# EAGLE design rgb_led (EAGLE 5.07)
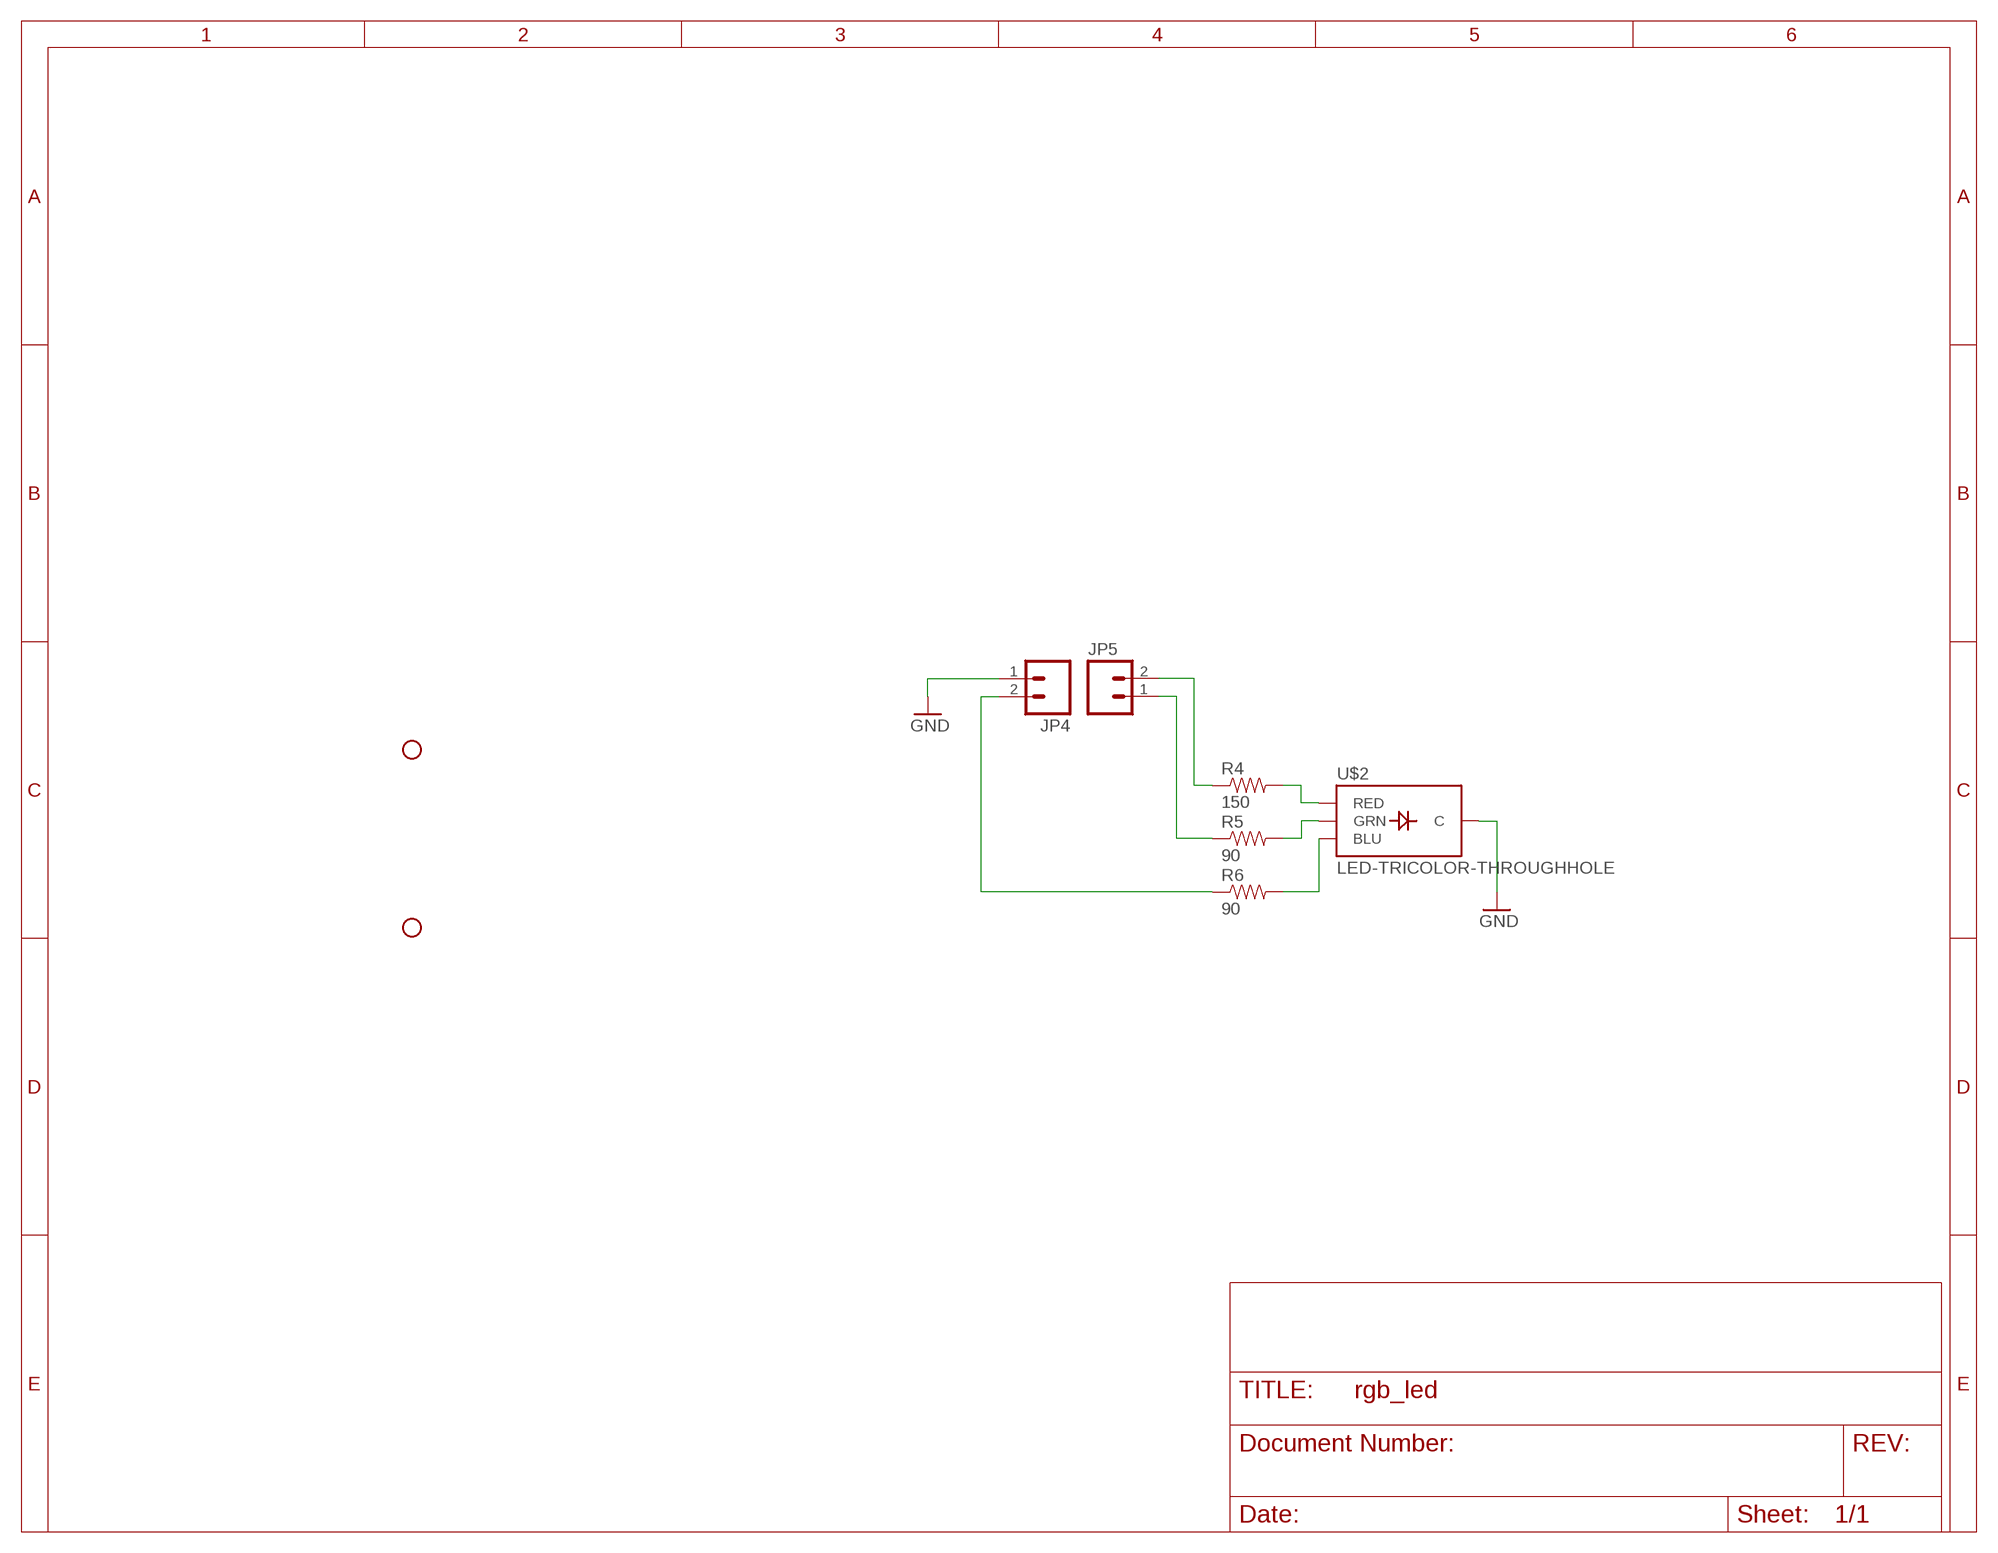
[diagram p0: schematic, sheet 1]

## Parts
JP4  M02PTH  [1X02]
JP5  M02PTH  [1X02]
JP9  STAND-OFF  [STAND-OFF]
JP10  STAND-OFF  [STAND-OFF]
R4  150  RESISTORPTH1  [AXIAL-0.3]
R5  90  RESISTORPTH1  [AXIAL-0.3]
R6  90  RESISTORPTH1  [AXIAL-0.3]
U$2  LED-TRICOLOR-THROUGHHOLE  [LED-TRICOLOR-THROUGHHOLE]

## Nets
GND: JP4.1 U$2.GND(C)
N$1: JP5.2 R4.P$1
N$2: JP5.1 R5.P$1
N$3: JP4.2 R6.P$1
N$4: R4.P$2 U$2.RED
N$5: R5.P$2 U$2.BLU(GRN)
N$17: R6.P$2 U$2.GRN(BLU)

## Library data of the parts
JP4 JP5 = SparkFun:M02: Header 2 Standard 2-pin 0.1" header. Use with straight break away headers (SKU : PRT-00116), right angle break away headers (PRT-00553), swiss pins (PRT-00743), machine pins (PRT-00117), and female headers (PRT-00115). Molex polarized connector foot print use with SKU : PRT-08233 with associated crimp pins and housings.
JP9 JP10 = SparkFun:STAND-OFF: Stand Off This is the mechanical footprint for a #4 phillips button head screw. Use the keepout ring to avoid running the screw head into surrounding components. SKU : PRT-00447
R4-R6 = SparkFun:RESISTOR: Resistor Basic schematic elements and footprints for 0603, 1206, and PTH 1/10th watt (small) resistors.
U$2 = SparkFun:LED-TRICOLOR-THROUGHHOLE

## Net classes
0 signal: width 0.381 mm, drill 0.813 mm, clearance 0.254 mm
1 drive: width 1.778 mm, drill 0.813 mm, clearance 0.254 mm

## Board
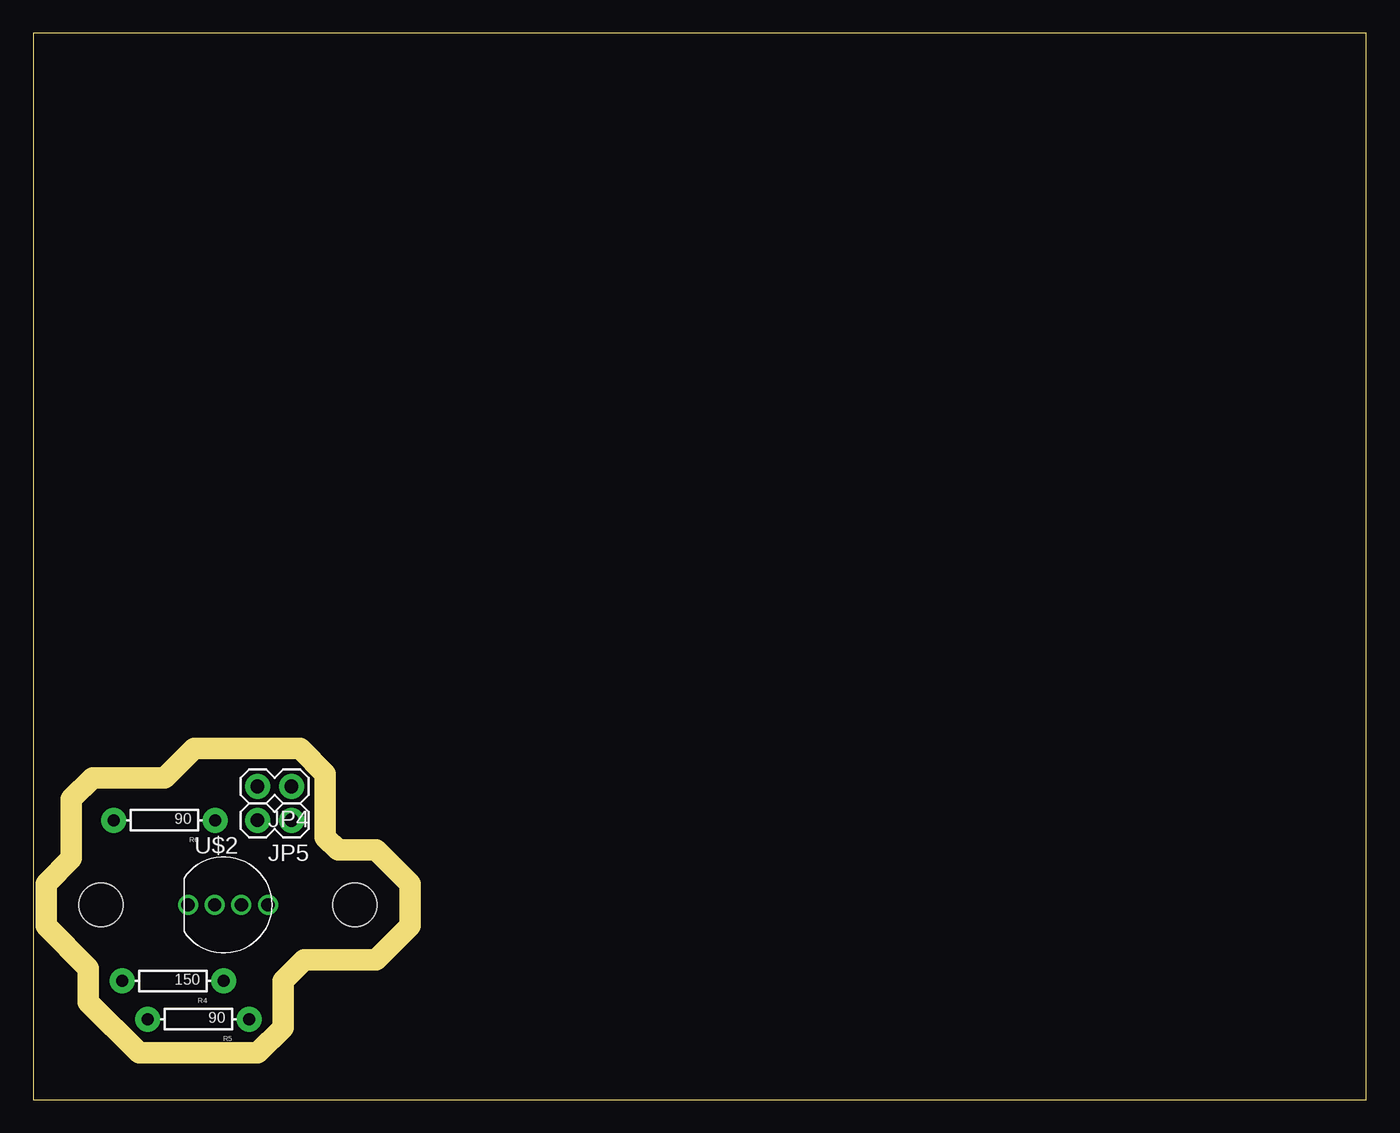
[diagram p1: board, top side]
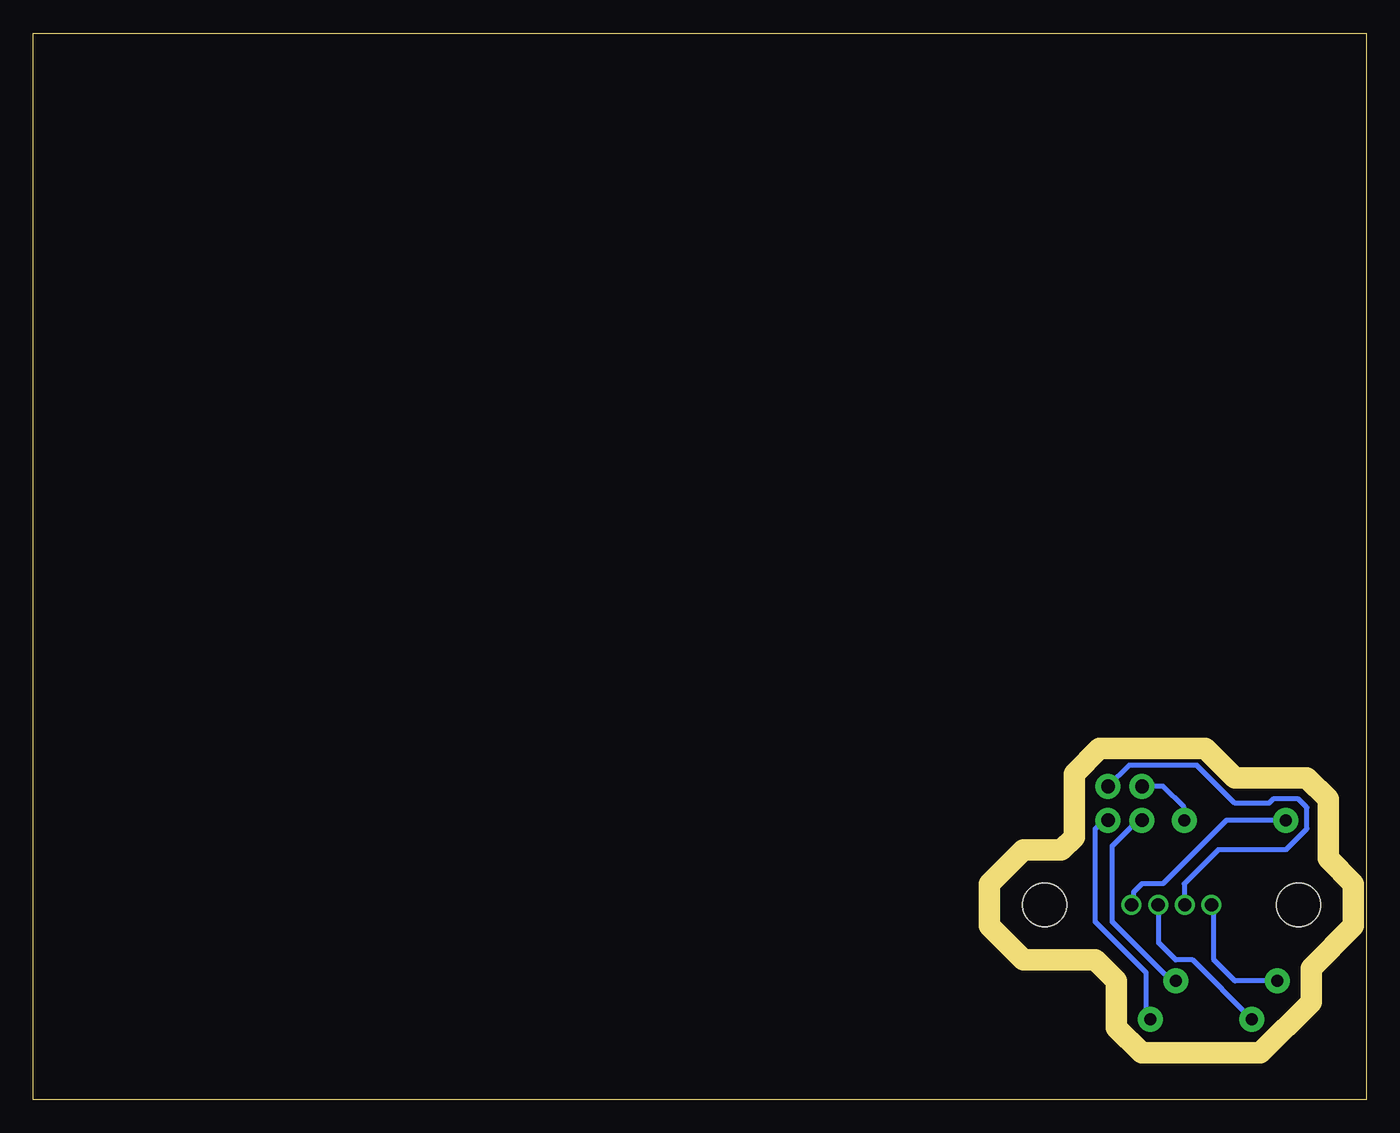
[diagram p2: board, bottom side, seen from below]

Size 100 x 80 mm. Coordinates in mm from the lower left corner, seen from the top.
Outline: 0,0 100,0 100,80 0,80 0,0
Copper layers (1*16): Top 0.035mm / dielectric 1.5mm / Bottom 0.035mm
Design rules "default *": minimum track width 15mil, minimum drill 24mil, track to track 15mil, track to pad 15mil, pad to pad 8mil, via to via 8mil, smd to smd 8mil, copper to edge 63mil, drill to drill 8mil, minimum pad ring 10mil, minimum via ring 8mil, stop-mask expansion 4mil, vias tented up to drill 0mil, thermal gap 10mil
Milling: 22 lines

### Footprints (pad centres in the part's own frame; a part is rotated, then mirrored left to right if it is on the bottom)
1X02 = drill 1.016 pad 1.88 round: 1 0,0; 2 2.54,0
STAND-OFF = hole 3.302: 0,0
AXIAL-0.3 = drill 0.9 pad 1.88 round: P$1 -3.81,0; P$2 3.81,0
LED-TRICOLOR-THROUGHHOLE = drill 1 round: BLU 1,0; GND -1,0; GRN 3,0; RED -3,0

### Placement (x,y rotation side)
JP4  19.37,23.5 180 top
JP5  19.37,20.95 180 top
JP9  5.08,14.61 0 top
JP10  24.13,14.61 0 top
R4  10.48,8.89 180 top
R5  12.38,6.03 180 top
R6  9.84,20.95 180 top
U$2  14.61,14.61 0 top

### Tracks (layer width: path | path; a pad name or v marks a point on that pad's centre or on a via)
GND
  Bottom 0.381: JP4.1 17.78,25.08 12.7,25.08 9.84,22.23 7.3,22.23 6.99,22.54 5.08,22.54 4.45,21.91 4.45,20.32 6.03,18.73 11.11,18.73 13.65,16.19 13.65,14.65 U$2.GND
N$1
  Bottom 0.381: R4.P$1 14.61,8.89 19.05,13.34 19.05,19.05 17.14,20.95 JP5.2
N$2
  Bottom 0.381: R5.P$1 16.51,6.35 16.51,9.53 20.32,13.34 20.32,20.32 19.68,20.95 JP5.1
N$3
  Bottom 0.381: JP4.2 15.24,23.5 13.65,21.91 R6.P$1
N$4
  Bottom 0.381: R4.P$2 9.84,8.89 11.43,10.48 11.43,14.43 U$2.RED
N$5
  Bottom 0.381: R5.P$2 13.02,10.48 14.29,10.48 15.56,11.75 15.56,14.56 U$2.BLU
N$17
  Bottom 0.381: R6.P$2 10.48,20.95 15.24,16.19 16.83,16.19 17.46,15.56 17.46,14.75 U$2.GRN